# EAGLE schematic irisc (EAGLE 9.2.2)
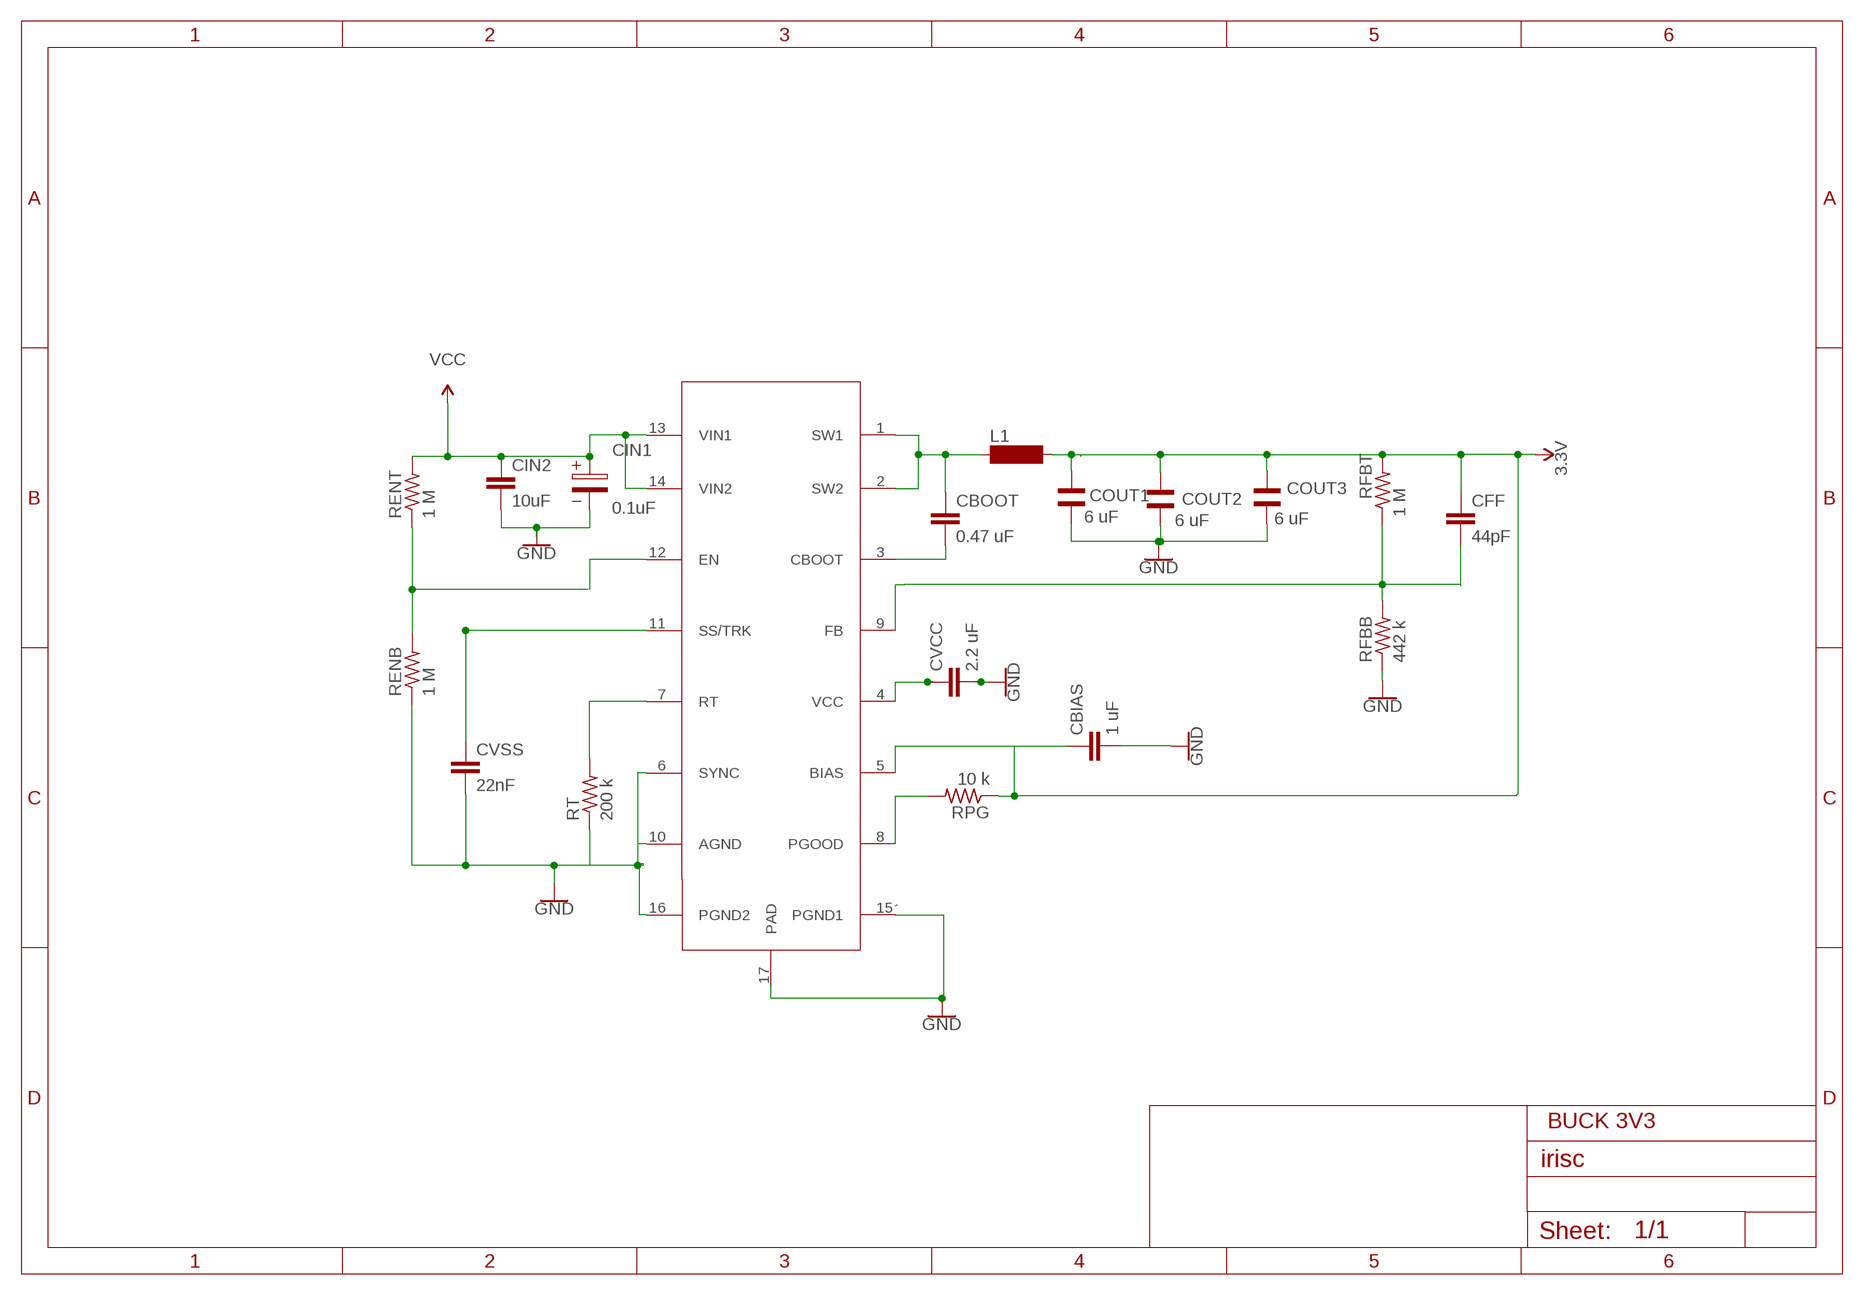
[diagram p0: schematic, sheet 1]

## Parts
BUCK3V1  BUCK3V3  [SOP65P640X120-17N]
CBIAS  1 uF  CC1210  [C1210]
CBOOT  0.47 uF  CC1210  [C1210]
CFF  44pF  CC0603  [C0603]
CIN1  0.1uF  WCAP-PTHR_6,3X8_870055673001  [6.3X2.5X0.9(DXAXB)]
CIN2  10uF  C  [C0805]
COUT1  6 uF  WCAP-CSGP_0805_885012006018_WAVE  [WCAP-CSGP_0805_WAVE]
COUT2  6 uF  WCAP-CSGP_0805_885012006018_WAVE  [WCAP-CSGP_0805_WAVE]
COUT3  6 uF  WCAP-CSGP_0805_885012006018_WAVE  [WCAP-CSGP_0805_WAVE]
CVCC  2.2 uF  CC1210  [C1210]
CVSS  22nF  CC1206  [C1206]
L1  BS11  [BS11]
RENB  1 M  FLIPFLOP-RES  [0805-THM]
RENT  1 M  FLIPFLOP-RES  [0805-THM]
RFBB  442 k  FLIPFLOP-RES  [0805-THM]
RFBT  1 M  FLIPFLOP-RES  [0805-THM]
RPG  10 k  FLIPFLOP-RES  [0805-THM]
RT  200 k  FLIPFLOP-RES  [0805-THM]

## Nets
3.3V: BUCK3V1.5(BIAS) CBIAS.1 CFF.1 COUT1.2 COUT2.2 COUT3.2 L1.2 RFBT.2 RPG.1
GND: CBIAS.2 CIN1.2 CIN2.2 COUT1.1 COUT2.1 COUT3.1 CVCC.2 RFBB.1
N$1: BUCK3V1.1(SW1) BUCK3V1.2(SW2) CBOOT.1 L1.1
N$2: BUCK3V1.7(RT) RT.2
N$3: BUCK3V1.11(SS/TRK) CVSS.1
N$4: BUCK3V1.3(CBOOT) CBOOT.2
N$6: BUCK3V1.9(FB)
N$8: CFF.2 RFBB.2 RFBT.1
N$9: BUCK3V1.12(EN)
N$12: BUCK3V1.4(VCC) CVCC.1
N$13: BUCK3V1.8(PGOOD) RPG.2
N$130: RENB.2 RENT.1
PGND1: BUCK3V1.15(PGND1) BUCK3V1.17(PAD) ; supply symbol labelled GND
PGND2: BUCK3V1.6(SYNC) BUCK3V1.10(AGND) BUCK3V1.16(PGND2) CVSS.2 RENB.1 RT.1 ; supply symbol labelled GND
VCC: BUCK3V1.13(VIN1) BUCK3V1.14(VIN2) CIN1.1 CIN2.1 RENT.2

## Notes on the sheet
- BUCK 3V3

## Library data of the parts
BUCK3V1 = SOP65P640X120-17N:BUCK3V3: USED FOR IRISC - step down to 3V3
CBIAS CBOOT CFF CIN2 CVCC CVSS = eagle-ltspice:C: CAPACITOR, European symbol; SPICEMODEL: NONE; SPICEPREFIX: C
CIN1 = Wurth_Elektronik_Passive_Capacitors_rev18b:WCAP-PTHR: WCAP-PTHR Aluminum Polymer Capacitors Characteristics Aluminum Polymer Capacitor Recommended soldering: Wave Operating temperature: -55°C to +105°C High reliability series Low ESR at high frequency range High permissible ripple current Load life: 2000h @ +105°C Package name and Variant abbreviation: Package: D X A X B = Diameter of the outline X Pitch of the hole X Diameter of the hole. Variant: D X L X P X Ø = Diameter of the body part X Height of the body part X Pitch of the pin X Diameter of the pin. <http://katalog.we-online.de/media/images/eisos/WCAP-PTHR_pf2.jpg> Details see: http://katalog.we-online.de/en/pbs/WCAP-PTHR/ Created: 2015-02-06 2015 (C) Wurth Elektronik; WE-NUMBER: 870055673001/10uF
COUT1-COUT3 = Wurth_Elektronik_Passive_Capacitors_rev18b:WCAP-CSGP_0805: WCAP-CSGP Ceramic Capacitors Characteristics Multilayer Ceramic Chip Capacitor Recommended soldering:Reflow, for 0603 and 0805 wave soldering is also allowed Operating temperature:-55 °C to +125 °C; Ceramic characteristics: Class I - NPO ; Class II -X7R, X5R High performance ceramic High capacitance stability Minimal aging Termination:Cu/Ni/Sn <http://katalog.we-online.de/media/images/eisos/WCAP-CSGP_pf2.jpg> Details see: http://katalog.we-online.de/en/pbs/WCAP-CSGP-0805? Created: 2015-01-28 2015 (C) Wurth Elektronik; SPICEPREFIX: C
L1 = inductor-neosid:BS: INDUCTOR nominal inductance, magnetically screened; OC_FARNELL: unknown; OC_NEWARK: unknown
RENB RENT RFBB RFBT RPG RT = adafruit:FLIPFLOP-RES: Flip Flop resistor An 0805 resistor inside a standard 1/4W 5% resistor. Makes for easy mods; SPICEPREFIX: R